# Altium schematic sheet CTRL_Connectors.SchDoc
size A4; SheetNumber: 8; SheetTotal: 13
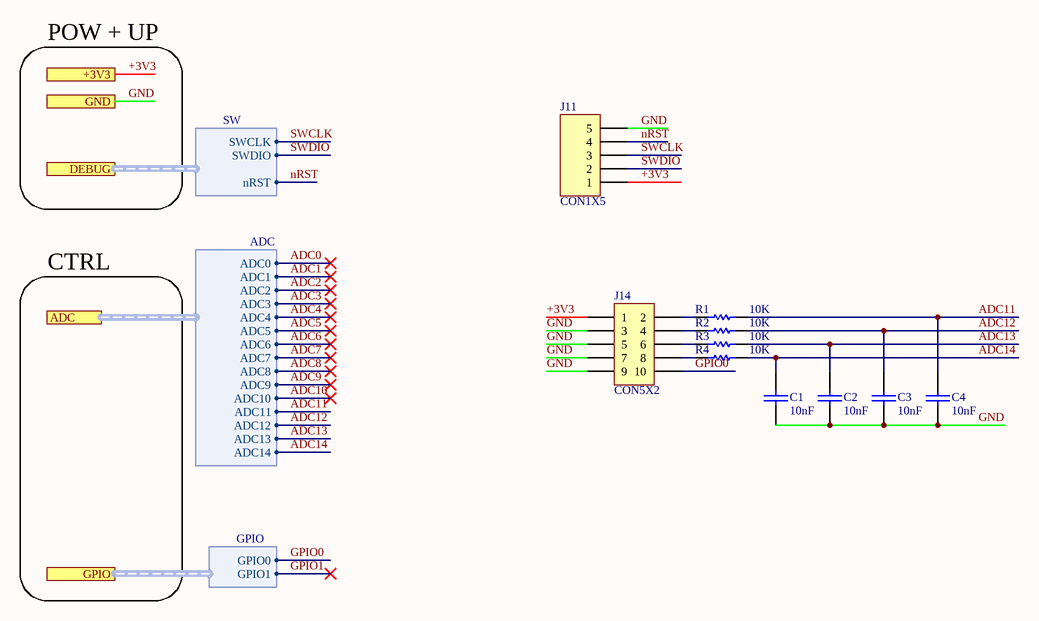
[diagram p0: CTRL_Connectors.SchDoc]

## Parts
C1  10nF  [0402-CAP-TDK]
C2  10nF  [0402-CAP-TDK]
C3  10nF  [0402-CAP-TDK]
C4  10nF  [0402-CAP-TDK]
J11  CON1X5  [SIP1X5]
J14  CON5X2  [SIP5X2]
R1  10K  [0402-RES-PANASONIC]
R2  10K  [0402-RES-PANASONIC]
R3  10K  [0402-RES-PANASONIC]
R4  10K  [0402-RES-PANASONIC]

## Ports
+3V3 (see AudioDSP-v3.0.0c_top[2B], ADC_Block[1A], ADC_Interface[1B], DAC_Block[1B], DSP_Block[1A], IN_Connectors[3B], MCU_Block[1A], OUT_Connectors[3B], PLL_Block[1A], POW_Block[4B]), ADC (harness ADC, see AudioDSP-v3.0.0c_top[2B], MCU_Block[4C]), DEBUG (harness SW, see AudioDSP-v3.0.0c_top[2B], MCU_Block[1B]), GND (see AudioDSP-v3.0.0c_top[2B], ADC_Block[1B], ADC_Interface[1B], DAC_Block[1B], DSP_Block[1A], IN_Connectors[3A], LPF_Block[1B], LPF_Interface[1B], MCU_Block[1B], OUT_Connectors[3B], PLL_Block[1A], POW_Block[1B]), GPIO (harness GPIO, see AudioDSP-v3.0.0c_top[2B], MCU_Block[4D])

## Harnesses
SW: SWCLK, SWDIO, nRST
ADC: ADC0, ADC1, ADC2, ADC3, ADC4, ADC5, ADC6, ADC7, ADC8, ADC9, ADC10, ADC11, ADC12, ADC13, ADC14
GPIO: GPIO0, GPIO1

## Nets
+3V3: J11.1 J14.1 ; port +3V3
ADC0: port ADC.ADC0
ADC1: port ADC.ADC1
ADC2: port ADC.ADC2
ADC3: port ADC.ADC3
ADC4: port ADC.ADC4
ADC5: port ADC.ADC5
ADC6: port ADC.ADC6
ADC7: port ADC.ADC7
ADC8: port ADC.ADC8
ADC9: port ADC.ADC9
ADC10: port ADC.ADC10
ADC11: C4.2 R1.2 ; port ADC.ADC11
ADC12: C3.2 R2.2 ; port ADC.ADC12
ADC13: C2.2 R3.2 ; port ADC.ADC13
ADC14: C1.2 R4.2 ; port ADC.ADC14
GND: C1.1 C2.1 C3.1 C4.1 J11.5 J14.3 J14.5 J14.7 J14.9 ; port GND
GPIO0: J14.10 ; port GPIO.GPIO0
GPIO1: port GPIO.GPIO1
nRST: J11.4 ; port DEBUG.nRST
SWCLK: J11.3 ; port DEBUG.SWCLK
SWDIO: J11.2 ; port DEBUG.SWDIO
NetJ14_2: J14.2 R1.1
NetJ14_4: J14.4 R2.1
NetJ14_6: J14.6 R3.1
NetJ14_8: J14.8 R4.1

## Notes on the sheet
- POW + UP
- CTRL

## Library data of the parts
C1-C4 = CAP-SMD
R1-R4 = RES-SMD